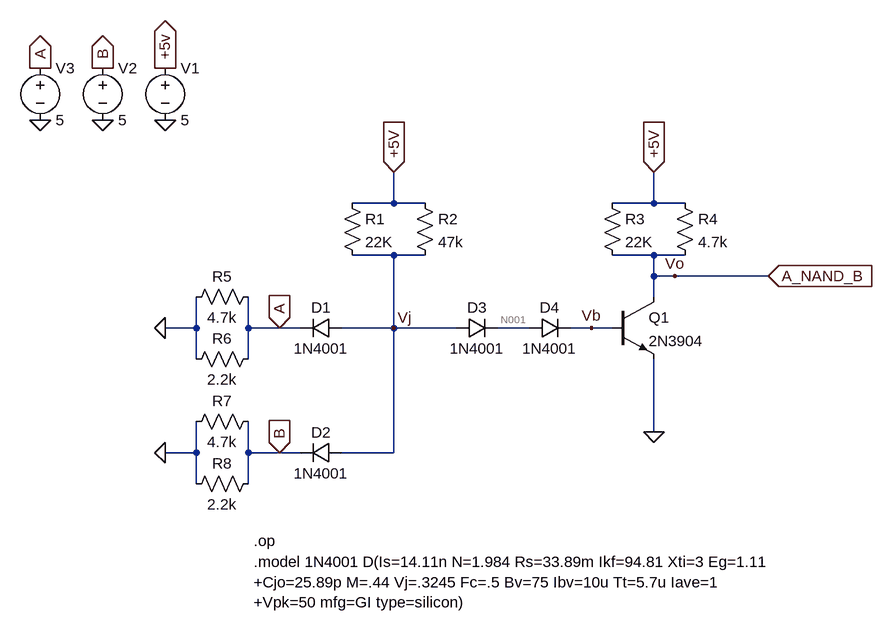
[diagram p0: schematic SerranoNAND.asc]
SerranoNAND.asc, the LTspice schematic file:
Version 4
SHEET 1 880 680
WIRE 0 -80 0 -128
WIRE 0 -80 -64 -80
WIRE 48 -80 0 -80
WIRE 400 -80 400 -128
WIRE 400 -80 336 -80
WIRE 448 -80 400 -80
WIRE 0 0 -64 0
WIRE 48 0 0 0
WIRE 400 0 336 0
WIRE 448 0 400 0
WIRE 400 32 400 0
WIRE 432 32 400 32
WIRE 576 32 432 32
WIRE 400 64 400 32
WIRE -304 112 -304 64
WIRE -304 112 -352 112
WIRE -224 112 -224 64
WIRE -176 112 -224 112
WIRE -144 112 -176 112
WIRE 0 112 0 0
WIRE 0 112 -80 112
WIRE 96 112 0 112
WIRE 208 112 160 112
WIRE 304 112 272 112
WIRE 336 112 304 112
WIRE -304 160 -304 112
WIRE -224 160 -224 112
WIRE 400 272 400 160
WIRE -304 304 -304 256
WIRE -304 304 -352 304
WIRE -224 304 -224 256
WIRE -176 304 -224 304
WIRE -144 304 -176 304
WIRE 0 304 0 112
WIRE 0 304 -80 304
WIRE -304 352 -304 304
WIRE -224 352 -224 304
FLAG -176 112 A
IOPIN -176 112 In
FLAG 0 -128 +5V
IOPIN 0 -128 In
FLAG 400 -128 +5V
IOPIN 400 -128 In
FLAG 400 272 0
FLAG 576 32 A_NAND_B
IOPIN 576 32 In
FLAG 0 112 Vj
FLAG -352 -208 0
FLAG -352 -288 +5v
IOPIN -352 -288 Out
FLAG -448 -208 0
FLAG -448 -288 B
IOPIN -448 -288 Out
FLAG -544 -208 0
FLAG -544 -288 A
IOPIN -544 -288 Out
FLAG 304 112 Vb
FLAG 432 32 Vo
FLAG -176 304 B
IOPIN -176 304 In
FLAG -352 112 0
FLAG -352 304 0
SYMBOL diode -80 96 R90
WINDOW 0 0 32 VBottom 2
WINDOW 3 32 32 VTop 2
SYMATTR InstName D1
SYMATTR Value 1N4001
SYMBOL diode -80 288 R90
WINDOW 0 0 32 VBottom 2
WINDOW 3 32 32 VTop 2
SYMATTR InstName D2
SYMATTR Value 1N4001
SYMBOL res -80 -96 R0
SYMATTR InstName R1
SYMATTR Value 22K
SYMBOL res 32 -96 R0
SYMATTR InstName R2
SYMATTR Value 47k
SYMBOL diode 96 128 R270
WINDOW 0 32 32 VTop 2
WINDOW 3 0 32 VBottom 2
SYMATTR InstName D3
SYMATTR Value 1N4001
SYMBOL diode 208 128 R270
WINDOW 0 32 32 VTop 2
WINDOW 3 0 32 VBottom 2
SYMATTR InstName D4
SYMATTR Value 1N4001
SYMBOL npn 336 64 R0
SYMATTR InstName Q1
SYMATTR Value 2N3904
SYMBOL res 320 -96 R0
SYMATTR InstName R3
SYMATTR Value 22K
SYMBOL res 432 -96 R0
SYMATTR InstName R4
SYMATTR Value 4.7k
SYMBOL voltage -352 -304 R0
WINDOW 123 0 0 Left 0
WINDOW 39 0 0 Left 0
SYMATTR InstName V1
SYMATTR Value 5
SYMBOL voltage -448 -304 R0
WINDOW 123 0 0 Left 0
WINDOW 39 0 0 Left 0
SYMATTR InstName V2
SYMATTR Value 5
SYMBOL voltage -544 -304 R0
WINDOW 123 0 0 Left 0
WINDOW 39 0 0 Left 0
SYMATTR InstName V3
SYMATTR Value 5
SYMBOL res -208 48 R90
WINDOW 0 0 56 VBottom 2
WINDOW 3 32 56 VTop 2
SYMATTR InstName R5
SYMATTR Value 4.7k
SYMBOL res -208 144 R90
WINDOW 0 0 56 VBottom 2
WINDOW 3 32 56 VTop 2
SYMATTR InstName R6
SYMATTR Value 2.2k
SYMBOL res -208 240 R90
WINDOW 0 0 56 VBottom 2
WINDOW 3 32 56 VTop 2
SYMATTR InstName R7
SYMATTR Value 4.7k
SYMBOL res -208 336 R90
WINDOW 0 0 56 VBottom 2
WINDOW 3 32 56 VTop 2
SYMATTR InstName R8
SYMATTR Value 2.2k
TEXT -216 472 Left 2 !.model 1N4001 D(Is=14.11n N=1.984 Rs=33.89m Ikf=94.81 Xti=3 Eg=1.11\n+Cjo=25.89p M=.44 Vj=.3245 Fc=.5 Bv=75 Ibv=10u Tt=5.7u Iave=1\n+Vpk=50 mfg=GI type=silicon)
TEXT -216 440 Left 2 !.op

The netlist it stands for:
* SerranoNAND.asc
D1 Vj A 1N4001
D2 Vj B 1N4001
R1 +5V Vj 22K
R2 +5V Vj 47k
D3 Vj N001 1N4001
D4 N001 Vb 1N4001
Q1 Vo Vb 0 0 2N3904
R3 +5V Vo 22K
R4 +5V Vo 4.7k
V1 +5V 0 5
V2 B 0 5
V3 A 0 5
R5 A 0 4.7k
R6 A 0 2.2k
R7 B 0 4.7k
R8 B 0 2.2k
.model D D
.lib standard.dio
.model NPN NPN
.model PNP PNP
.lib standard.bjt
.model 1N4001 D(Is=14.11n N=1.984 Rs=33.89m Ikf=94.81 Xti=3 Eg=1.11
+Cjo=25.89p M=.44 Vj=.3245 Fc=.5 Bv=75 Ibv=10u Tt=5.7u Iave=1
+Vpk=50 mfg=GI type=silicon)
.op
.backanno
.end

* Results of the author's LTspice run, read from the files saved beside the schematic
* Operating Point:
*   V(vj) = 1.674 V
*   V(a) = 5 V
*   V(b) = 5 V
*   V(+5v) = 5 V
*   V(n001) = 1.178 V
*   V(vb) = 682.1 mV
*   V(vo) = 26.65 mV
*   Ic(Q1) = 1.284 mA
*   Ib(Q1) = 222 µA
*   Ie(Q1) = -1.506 mA
*   I(D1) = -14.11 nA
*   I(D2) = -14.11 nA
*   I(D3) = 222 µA
*   I(D4) = 222 µA
*   I(R1) = 151.2 µA
*   I(R2) = 70.77 µA
*   I(R3) = 226.1 µA
*   I(R4) = 1.058 mA
*   I(R5) = 1.064 mA
*   I(R6) = 2.273 mA
*   I(R7) = 1.064 mA
*   I(R8) = 2.273 mA
*   I(V1) = -1.506 mA
*   I(V2) = -3.337 mA
*   I(V3) = -3.337 mA
* From the log:
*   Semiconductor Device Operating Points:
*                           --- Diodes ---
*   Name:      d1          d2          d3          d4
*   Model:   1n4001      1n4001      1n4001      1n4001
*   Id:     -1.41e-08   -1.41e-08    2.22e-04    2.22e-04
*   Vd:     -3.33e+00   -3.33e+00    4.96e-01    4.96e-01
*   Req:     1.00e+12    1.00e+12    2.31e+02    2.31e+02
*   CAP:     8.93e-12    8.93e-12    2.47e-08    2.47e-08
*                           --- Bipolar Transistors ---
*   Name:       q1
*   Model:    2n3904
*   Ib:       2.22e-04
*   Ic:       1.28e-03
*   Vbe:      6.82e-01
*   Vbc:      6.55e-01
*   Vce:      2.66e-02
*   BetaDC:   5.79e+00
*   Gm:       5.76e-02
*   Rpi:      3.27e+03
*   Rx:       2.00e+01
*   Ro:       3.06e+01
*   Cbe:      4.43e-11
*   Cbc:      8.28e-09
*   Cjs:      0.00e+00
*   BetaAC:   1.88e+02
*   Cbx:      0.00e+00
*   Ft:       1.10e+06